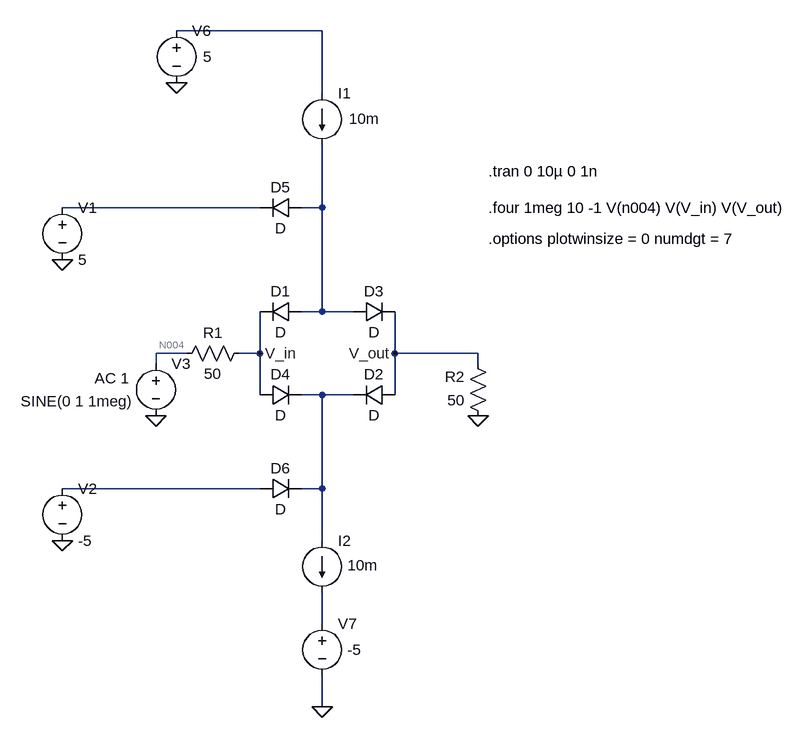
[diagram p0: schematic Diode-Quartet.asc]
Diode-Quartet.asc, the LTspice schematic file:
Version 4
SHEET 1 936 756
WIRE 176 -304 -48 -304
WIRE 176 -208 176 -304
WIRE 80 -32 -224 -32
WIRE 176 -32 176 -128
WIRE 176 -32 144 -32
WIRE 176 128 176 -32
WIRE 176 128 144 128
WIRE 224 128 176 128
WIRE -32 192 -80 192
WIRE 80 192 80 128
WIRE 80 192 48 192
WIRE 288 192 288 128
WIRE 416 192 288 192
WIRE -80 208 -80 192
WIRE 416 208 416 192
WIRE 80 256 80 192
WIRE 176 256 144 256
WIRE 224 256 176 256
WIRE 288 256 288 192
WIRE 80 400 -224 400
WIRE 176 400 176 256
WIRE 176 400 144 400
WIRE 176 480 176 400
WIRE 176 608 176 560
WIRE 176 736 176 688
FLAG -224 48 0
FLAG -80 288 0
FLAG 416 288 0
FLAG -224 480 0
FLAG -48 -224 0
FLAG 176 736 0
FLAG 288 192 V_out
FLAG 80 192 V_in
SYMBOL diode 144 112 R90
WINDOW 0 0 32 VBottom 2
WINDOW 3 32 32 VTop 2
SYMATTR InstName D1
SYMBOL diode 288 240 R90
WINDOW 0 0 32 VBottom 2
WINDOW 3 32 32 VTop 2
SYMATTR InstName D2
SYMBOL diode 224 144 R270
WINDOW 0 32 32 VTop 2
WINDOW 3 0 32 VBottom 2
SYMATTR InstName D3
SYMBOL diode 80 272 R270
WINDOW 0 32 32 VTop 2
WINDOW 3 0 32 VBottom 2
SYMATTR InstName D4
SYMBOL diode 144 -48 R90
WINDOW 0 0 32 VBottom 2
WINDOW 3 32 32 VTop 2
SYMATTR InstName D5
SYMBOL diode 80 416 R270
WINDOW 0 32 32 VTop 2
WINDOW 3 0 32 VBottom 2
SYMATTR InstName D6
SYMBOL voltage -224 -48 R0
WINDOW 123 0 0 Left 0
WINDOW 39 0 0 Left 0
SYMATTR InstName V1
SYMATTR Value 5
SYMBOL voltage -224 384 R0
WINDOW 123 0 0 Left 0
WINDOW 39 0 0 Left 0
SYMATTR InstName V2
SYMATTR Value -5
SYMBOL voltage -80 192 R0
WINDOW 3 -208 74 Left 2
WINDOW 123 -94 38 Left 2
WINDOW 39 0 0 Left 0
SYMATTR Value SINE(0 1 1meg)
SYMATTR Value2 AC 1
SYMATTR InstName V3
SYMBOL res 64 176 R90
WINDOW 0 0 56 VBottom 2
WINDOW 3 32 56 VTop 2
SYMATTR InstName R1
SYMATTR Value 50
SYMBOL res 432 304 R180
WINDOW 0 36 76 Left 2
WINDOW 3 36 40 Left 2
SYMATTR InstName R2
SYMATTR Value 50
SYMBOL voltage -48 -320 R0
WINDOW 123 0 0 Left 0
WINDOW 39 0 0 Left 0
WINDOW 3 41 56 Left 2
SYMATTR Value 5
SYMATTR InstName V6
SYMBOL voltage 176 592 R0
WINDOW 123 0 0 Left 0
WINDOW 39 0 0 Left 0
WINDOW 3 39 56 Left 2
SYMATTR Value -5
SYMATTR InstName V7
SYMBOL current 176 -208 R0
WINDOW 123 0 0 Left 0
WINDOW 39 0 0 Left 0
WINDOW 3 41 39 Left 2
SYMATTR Value 10m
SYMATTR InstName I1
SYMBOL current 176 480 R0
WINDOW 123 0 0 Left 0
WINDOW 39 0 0 Left 0
WINDOW 3 39 38 Left 2
SYMATTR Value 10m
SYMATTR InstName I2
TEXT 432 -88 Left 2 !.tran 0 10µ 0 1n
TEXT 432 -32 Left 2 !.four 1meg 10 -1 V(n004) V(V_in) V(V_out)
TEXT 432 16 Left 2 !.options plotwinsize = 0 numdgt = 7

The netlist it stands for:
* Diode-Quartet.asc
D1 N003 V_in D
D2 V_out N005 D
D3 N003 V_out D
D4 V_in N005 D
D5 N003 N002 D
D6 N006 N005 D
V1 N002 0 5
V2 N006 0 -5
V3 N004 0 SINE(0 1 1meg) AC 1
R1 V_in N004 50
R2 0 V_out 50
V6 N001 0 5
V7 N007 0 -5
I1 N001 N003 10m
I2 N005 N007 10m
.model D D
.lib standard.dio
.tran 0 10µ 0 1n
.four 1meg 10 -1 V(n004) V(V_in) V(V_out)
.options plotwinsize = 0 numdgt = 7
.backanno
.end